# EAGLE design tinyadder_r3 (EAGLE 9.2.2)
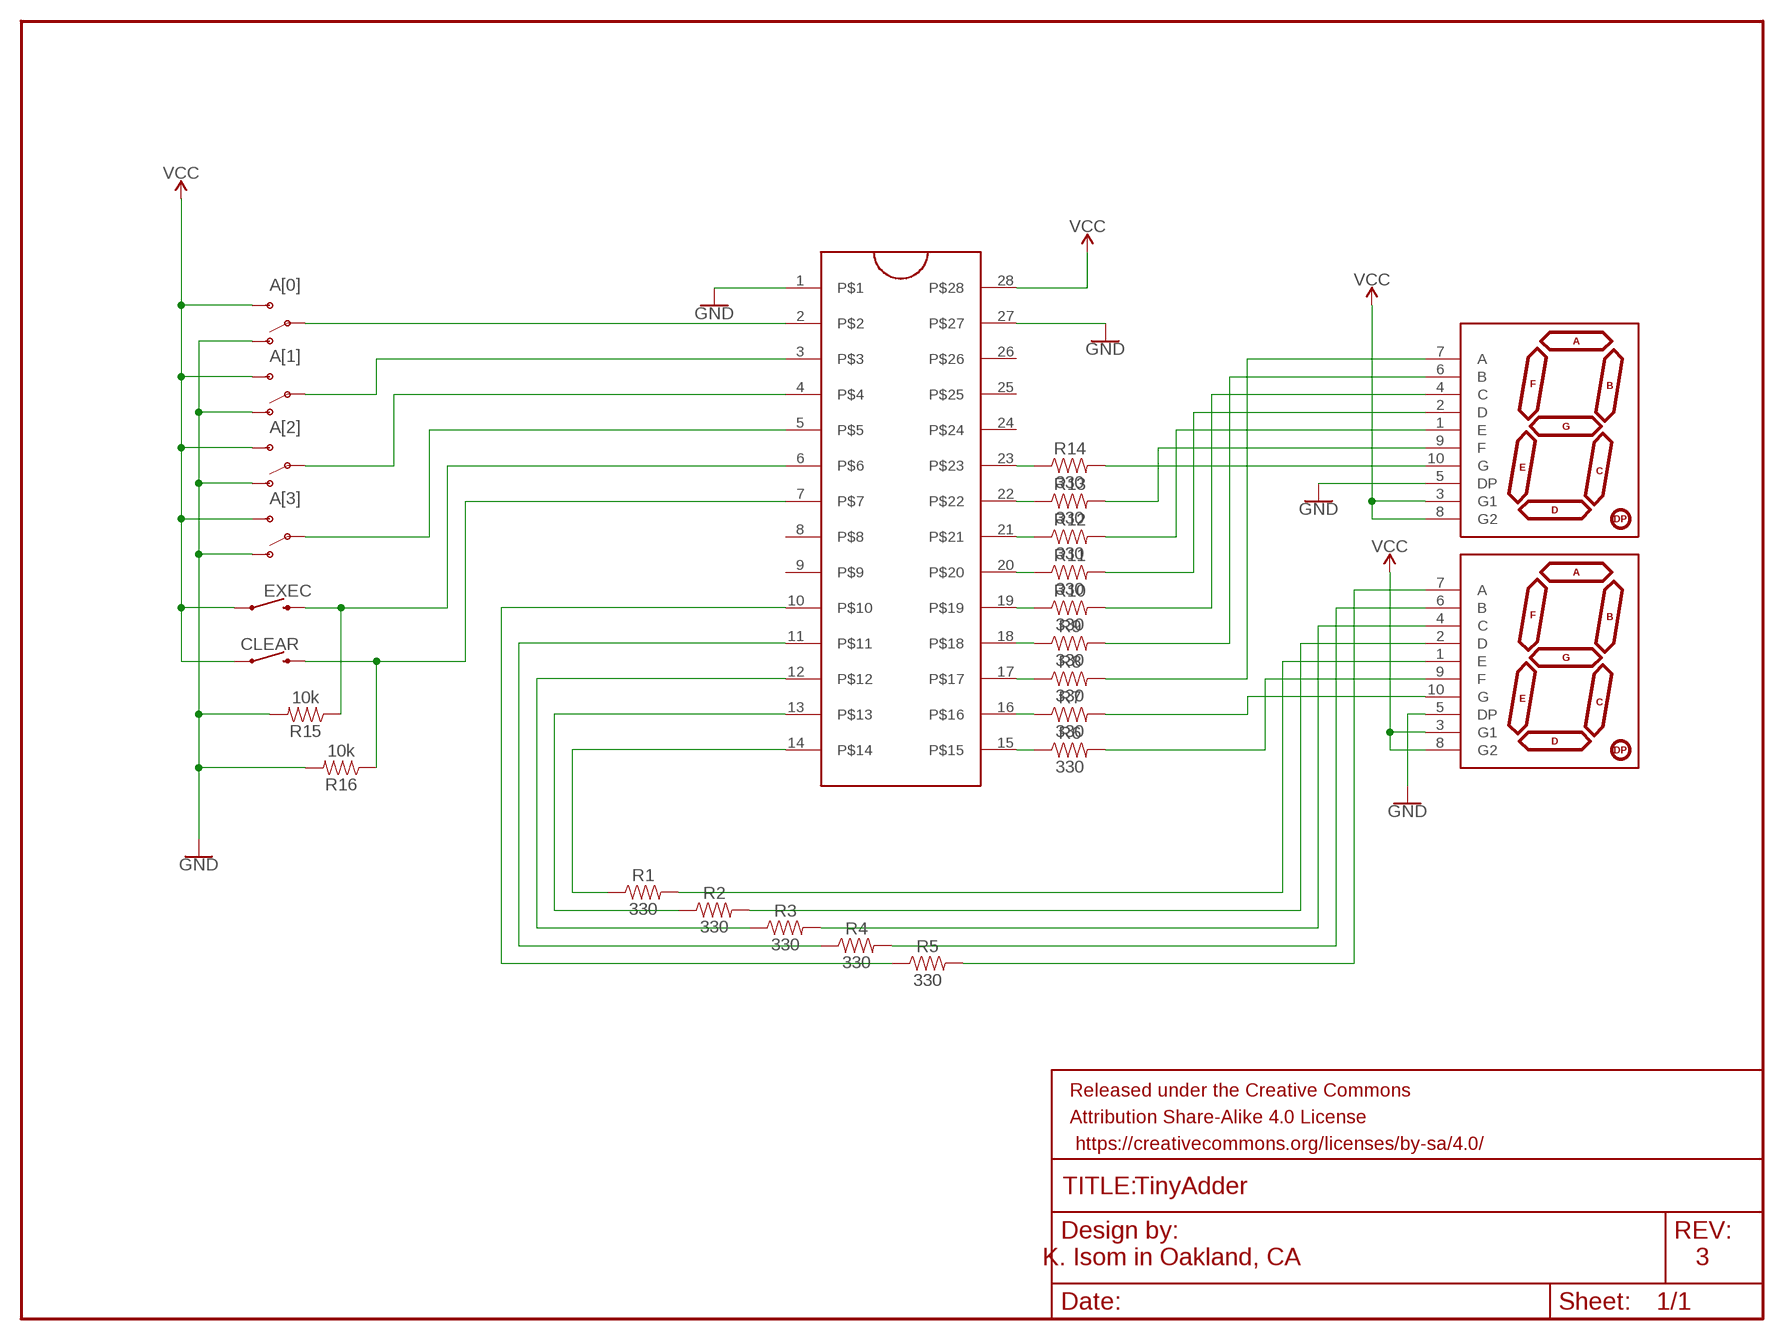
[diagram p0: schematic, sheet 1]

## Parts
A[0]  SWITCH-SPDT-PTH-11.6X4.0MM  [SWITCH_SPDT_PTH_11.6X4.0MM]
A[1]  SWITCH-SPDT-PTH-11.6X4.0MM  [SWITCH_SPDT_PTH_11.6X4.0MM]
A[2]  SWITCH-SPDT-PTH-11.6X4.0MM  [SWITCH_SPDT_PTH_11.6X4.0MM]
A[3]  SWITCH-SPDT-PTH-11.6X4.0MM  [SWITCH_SPDT_PTH_11.6X4.0MM]
CLEAR  MOMENTARY-SWITCH-SPST-PTH-6.0MM  [TACTILE_SWITCH_PTH_6.0MM]
EXEC  MOMENTARY-SWITCH-SPST-PTH-6.0MM  [TACTILE_SWITCH_PTH_6.0MM]
FRAME1  FRAME-LETTER  [CREATIVE_COMMONS]
J1  ZIFSOCKET-28-3"  [DIL28-3-ZIF_SOCKET]
R1  330  330OHM-HORIZ-1/10W-5%  [AXIAL-0.3]
R2  330  330OHM-HORIZ-1/10W-5%  [AXIAL-0.3]
R3  330  330OHM-HORIZ-1/10W-5%  [AXIAL-0.3]
R4  330  330OHM-HORIZ-1/10W-5%  [AXIAL-0.3]
R5  330  330OHM-HORIZ-1/10W-5%  [AXIAL-0.3]
R6  330  330OHM-HORIZ-1/10W-5%  [AXIAL-0.3]
R7  330  330OHM-HORIZ-1/10W-5%  [AXIAL-0.3]
R8  330  330OHM-HORIZ-1/10W-5%  [AXIAL-0.3]
R9  330  330OHM-HORIZ-1/10W-5%  [AXIAL-0.3]
R10  330  330OHM-HORIZ-1/10W-5%  [AXIAL-0.3]
R11  330  330OHM-HORIZ-1/10W-5%  [AXIAL-0.3]
R12  330  330OHM-HORIZ-1/10W-5%  [AXIAL-0.3]
R13  330  330OHM-HORIZ-1/10W-5%  [AXIAL-0.3]
R14  330  330OHM-HORIZ-1/10W-5%  [AXIAL-0.3]
R15  10k  10KOHM-HORIZ-1/4W-1%  [AXIAL-0.3]
R16  10k  10KOHM-HORIZ-1/4W-1%  [AXIAL-0.3]
U$1  YSD-1601AR4B-8  7-SEGMENT-1DIGIT-1INCH-RED  [7-SEGMENT-1"PTH]
U$2  YSD-1601AR4B-8  7-SEGMENT-1DIGIT-1INCH-RED  [7-SEGMENT-1"PTH]

## Nets
GND: A[0].1(O) A[1].1(O) A[2].1(O) A[3].1(O) J1.1 J1.27 R15.P$2 R16.P$2 U$1.5(DP) U$2.5(DP)
N$1: A[0].2(P) J1.2
N$2: A[1].2(P) J1.3
N$3: A[2].2(P) J1.4
N$4: A[3].2(P) J1.5
N$5: EXEC.3 J1.6 R15.P$1
N$6: CLEAR.3 J1.7 R16.P$1
N$7: J1.10 R5.P$1
N$8: J1.11 R4.P$1
N$9: J1.12 R3.P$1
N$10: J1.13 R2.P$1
N$11: R1.P$2 U$2.1(E)
N$12: R6.P$2 U$2.9(F)
N$13: R7.P$2 U$2.10(G)
N$14: R8.P$2 U$1.7(A)
N$15: R9.P$2 U$1.6(B)
N$16: R10.P$2 U$1.4(C)
N$17: R11.P$2 U$1.2(D)
N$18: R12.P$2 U$1.1(E)
N$19: R13.P$2 U$1.9(F)
N$20: J1.15 R6.P$1
N$21: J1.14 R1.P$1
N$22: R2.P$2 U$2.2(D)
N$23: R3.P$2 U$2.4(C)
N$24: R4.P$2 U$2.6(B)
N$25: R5.P$2 U$2.7(A)
N$26: J1.16 R7.P$1
N$27: J1.17 R8.P$1
N$28: J1.18 R9.P$1
N$29: J1.19 R10.P$1
N$30: J1.20 R11.P$1
N$31: J1.21 R12.P$1
N$32: J1.22 R13.P$1
N$33: J1.23 R14.P$1
N$34: R14.P$2 U$1.10(G)
VCC: A[0].3(S) A[1].3(S) A[2].3(S) A[3].3(S) CLEAR.1 EXEC.1 J1.28 U$1.3(G1) U$1.8(G2) U$2.3(G1) U$2.8(G2)
Unconnected: J1.8 J1.9 J1.24 J1.25 J1.26

## Notes on the sheet
- TinyAdder
- K. Isom in Oakland, CA | 3

## Library data of the parts
A[0] A[1] A[2] A[3] = SparkFun-Switches:SWITCH-SPDT: Single Pole, Double Throw (SPDT) Switch Single-pole, double-throw (SPDT) switch. Variant Overview SMD-AYZ0202 Surface Mount DPDT Switch <https://www.sparkfun.com/products/597> (COM-00597) Used on e.g. LilyPad Arduino USB - ATmega32U4 Board <https://www.sparkfun.com/products/12049> PTH-11.6X4.0MM SPDT Mini Power Switch <https://www.sparkfun.com/products/102> (COM-00102) Used on e.g. SparkFun Simon Says - Through-Hole Soldering Kit <https://www.sparkfun.com/products/10547> (KIT-10547) PTH-11.6X4.0MM-KIT KIT version of SPDT Mini Power Switch - Simplifies soldering by removing tStop of switch pins - only one side can be soldered. PTH-11.6X4.0MM-LOCK LOCK version of SPDT Mini Power Switch - Offset pins hold switch in place for easier soldering. SMD-RIGHT-ANGLE Surface Mount Right Angle Switch <https://www.sparkfun.com/products/10860> (COM-10860) Used on e.g. SparkFun ESP8266 Thing <https://www.sparkfun.com/products/13231>; PROD_ID: SWCH-08261; SF_SKU: COM-00102
CLEAR EXEC = SparkFun-Switches:MOMENTARY-SWITCH-SPST: Momentary Switch (Pushbutton) - SPST Normally-open (NO) SPST momentary switches (buttons, pushbuttons). Variants PTH-12MM - 12mm square, through-hole Momentary Pushbutton Switch - 12mm Square <https://www.sparkfun.com/products/9190> (COM-09190) PTH-6.0MM, PTH-6.0MM-KIT - 6.0mm square, through-hole Mini Pushbutton Switch <https://www.sparkfun.com/products/97> (COM-00097) KIT package intended for soldering kit's - only one side of pads' copper is exposed. PTH-RIGHT-ANGLE-KIT - Right-angle, through-hole Right Angle Tactile Button <https://www.sparkfun.com/products/10791> - Used on SparkFun BigTime Watch Kit <https://www.sparkfun.com/products/11734> SMD-12MM - 12mm square, surface-mount Tactile Button - SMD (12mm) <https://www.sparkfun.com/products/12993> (COM-12993) Used on SparkFun PicoBoard <https://www.sparkfun.com/products/11888> SMD-4.5MM - 4.5mm Square Trackball Switch Used on SparkFun Blackberry Trackballer Breakout <https://www.sparkfun.com/products/13169> SMD-4.6MMX2.8MM - 4.60mm x 2.80mm, surface mount Used on SparkFun SAMD21 Mini Breakout <https://www.sparkfun.com/products/13664> SMD-5.2MM, SMD-5.2-REDUNDANT - 5.2mm square, surface-mount Mini Pushbutton Switch - SMD <https://www.sparkfun.com/products/8720> (COM-08720) Used on Arduino Pro Mini <https://www.sparkfun.com/products/11114> REDUNDANT package connects both switch circuits together SMD-6.0X3.5MM - 6.0 x 3.5mm, surface mount Momentary Reset Switch SMD <https://www.sparkfun.com/products/8229> (COM-08229) SMD-6.2MM-TALL - 6.2mm square, surface mount Tactile Button - SMD (6mm) <https://www.sparkfun.com/products/12992> Used on SparkFun Digital Sandbox <https://www.sparkfun.com/products/12651> SMD-RIGHT-ANGLE - Right-angle, surface mount Used on SparkFun Block for Intel® Edison - Arduino <https://www.sparkfun.com/products/13036>; PROD_ID: SWCH-08441; SF_SKU: COM-00097
FRAME1 = SparkFun-Aesthetics:FRAME-LETTER: Schematic Frame - Letter Standard 8.5x11 US Letter frame
J1 = SparkFun-Connectors:ZIFSOCKET-28-3: ZIF Socket 28-Pin 0.3" Lever-action ZIF socket for 28-pin ICs SparkFun Products: ZIF Socket 28-Pin <https://www.sparkfun.com/products/9175>; PROD_ID: CONN-10960; SF_ID: PRT-09175
R1-R14 = SparkFun-Resistors:330OHM: 330Ω resistor A resistor is a passive two-terminal electrical component that implements electrical resistance as a circuit element. Resistors act to reduce current flow, and, at the same time, act to lower voltage levels within circuits. - Wikipedia; PROD_ID: RES-8371
R15 R16 = SparkFun-Resistors:10KOHM: 10kΩ resistor A resistor is a passive two-terminal electrical component that implements electrical resistance as a circuit element. Resistors act to reduce current flow, and, at the same time, act to lower voltage levels within circuits. - Wikipedia; PROD_ID: RES-12183
U$1 U$2 = SparkFun-LED:7-SEGMENT-1DIGIT-1INCH: 7-Segment Display, single digit, 1" EZ is for kits. Pads are only exposed on the bottom side to help prevent soldering in upside down. Datasheet (Red) <https://cdn.sparkfun.com/datasheets/Components/LED/YSD-160AR4B-8.pdf> Datasheet (Blue) <https://cdn.sparkfun.com/datasheets/Components/LED/YSD-160AB3C-8.pdf> SparkFun Products 7-Segment Display - LED (Red) <https://www.sparkfun.com/products/8546> (COM-08546) 7-Segment Display - LED (Blue) <https://www.sparkfun.com/products/9191> (COM-09191); PROD_ID: COMP-08615

## Board
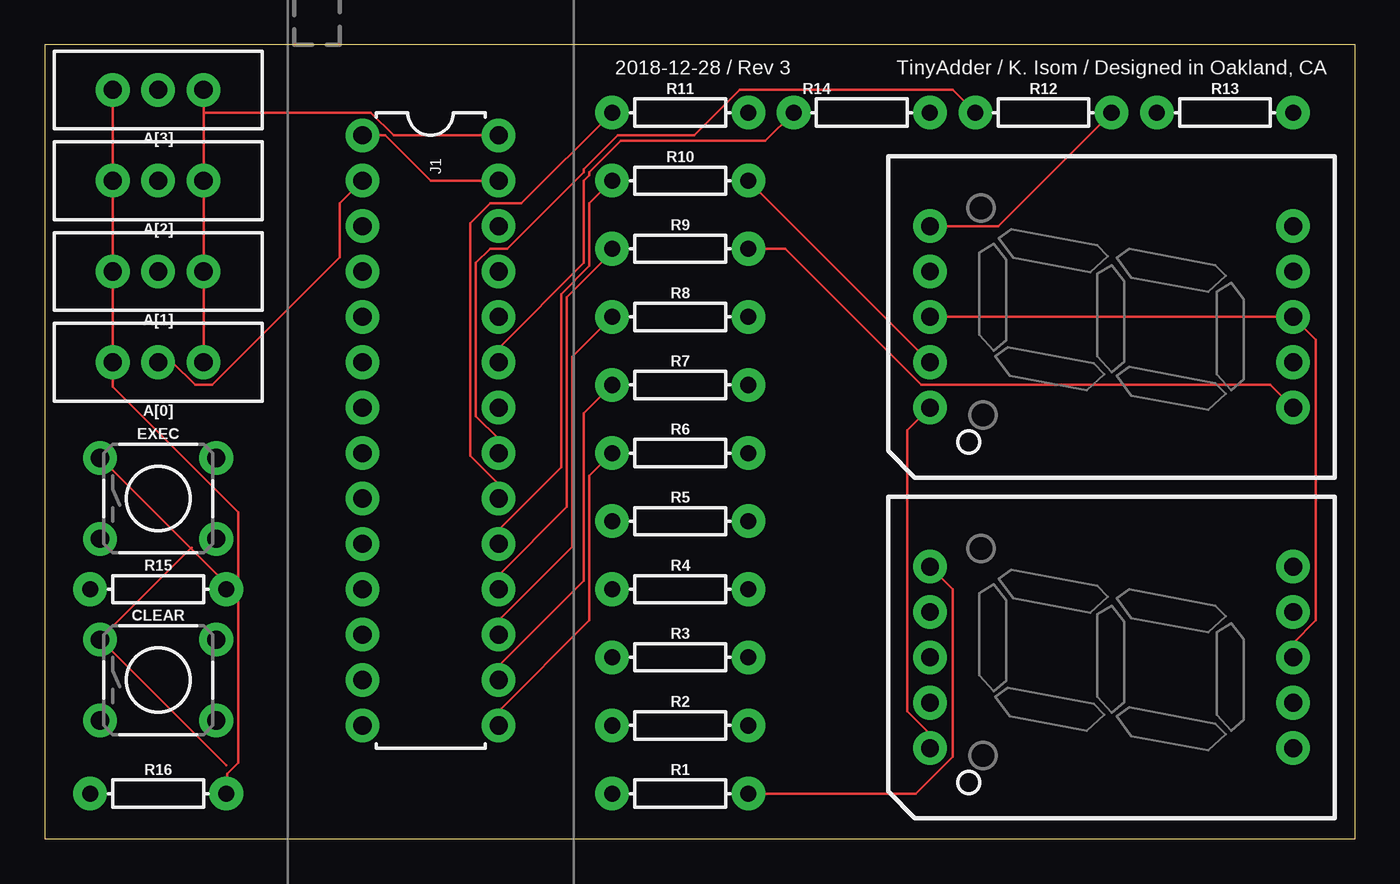
[diagram p1: board, top side]
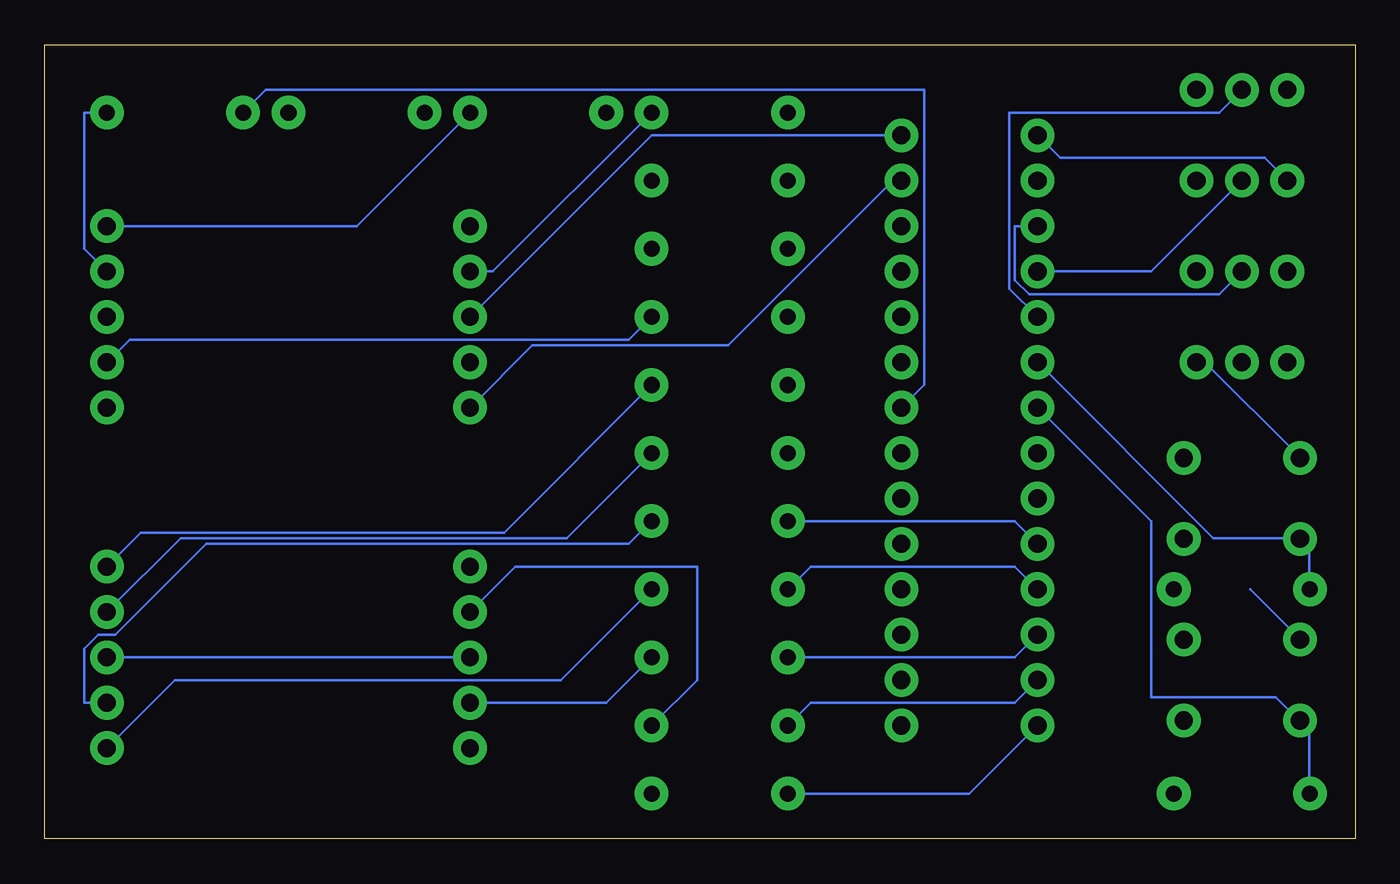
[diagram p2: board, bottom side, seen from below]

Size 73.33 x 44.44 mm. Coordinates in mm from the lower left corner, seen from the top.
Outline: 0,0 73.33,0 73.33,44.44 0,44.44 0,0
Copper layers (1*16): Top 0.035mm / dielectric 1.5mm / Bottom 0.035mm
Design rules "default": minimum track width 6mil, minimum drill 0.35mm, track to track 6mil, track to pad 6mil, pad to pad 6mil, via to via 6mil, smd to smd 6mil, copper to edge 40mil, drill to drill 6mil, minimum pad ring 10mil, minimum via ring 8mil, stop-mask expansion 4mil, vias tented up to drill 0mil, thermal gap 10mil

### Footprints (pad centres in the part's own frame; a part is rotated, then mirrored left to right if it is on the bottom)
SWITCH_SPDT_PTH_11.6X4.0MM = drill 1.016 pad 1.88: 1 0,2.54; 2 0,0; 3 0,-2.54
TACTILE_SWITCH_PTH_6.0MM = drill 1.016 pad 1.88: 1 -3.251,2.261; 2 3.251,2.261; 3 -3.251,-2.261; 4 3.251,-2.261
DIL28-3-ZIF_SOCKET = drill 1.016 pad 1.88: 1 -16.51,-3.81; 2 -13.97,-3.81; 3 -11.43,-3.81; 4 -8.89,-3.81; 5 -6.35,-3.81; 6 -3.81,-3.81; 7 -1.27,-3.81; 8 1.27,-3.81; 9 3.81,-3.81; 10 6.35,-3.81; 11 8.89,-3.81; 12 11.43,-3.81; 13 13.97,-3.81; 14 16.51,-3.81; 15 16.51,3.81; 16 13.97,3.81; 17 11.43,3.81; 18 8.89,3.81; 19 6.35,3.81; 20 3.81,3.81; 21 1.27,3.81; 22 -1.27,3.81; 23 -3.81,3.81; 24 -6.35,3.81; 25 -8.89,3.81; 26 -11.43,3.81; 27 -13.97,3.81; 28 -16.51,3.81
AXIAL-0.3 = drill 0.9 pad 1.88: P$1 -3.81,0; P$2 3.81,0
7-SEGMENT-1"PTH = drill 1 pad 1.88: 1 -5.08,-10.16; 2 -2.54,-10.16; 3 0,-10.16; 4 2.54,-10.16; 5 5.08,-10.16; 6 5.08,10.16; 7 2.54,10.16; 8 0,10.16; 9 -2.54,10.16; 10 -5.08,10.16

### Placement (x,y rotation side)
A[0]  6.35,26.67 90 top
A[1]  6.35,31.75 90 top
A[2]  6.35,36.83 90 top
A[3]  6.35,41.91 90 top
CLEAR  6.35,8.89 0 top
EXEC  6.35,19.05 0 top
FRAME1  21.59,-11.43 0 top  (outside the outline)
J1  21.59,22.86 270 top
R1  35.56,2.54 0 top
R2  35.56,6.35 0 top
R3  35.56,10.16 0 top
R4  35.56,13.97 0 top
R5  35.56,17.78 0 top
R6  35.56,21.59 0 top
R7  35.56,25.4 0 top
R8  35.56,29.21 0 top
R9  35.56,33.02 0 top
R10  35.56,36.83 0 top
R11  35.56,40.64 0 top
R12  55.88,40.64 0 top
R13  66.04,40.64 0 top
R14  45.72,40.64 0 top
R15  6.35,13.97 0 top
R16  6.35,2.54 0 top
U$1  59.69,29.21 270 top
U$2  59.69,10.16 270 top

### Tracks (layer width: path | path; a pad name or v marks a point on that pad's centre or on a via)
GND
  Top 0.152: U$2.5 49.53,5.87 48.26,7.14 48.26,22.86 U$1.5 | J1.1 19.05,39.37 21.59,36.83 J1.27 | A[3].1 A[2].1 A[1].1 A[0].1 3.81,25.3 10.82,18.29 10.82,14.48 10.21,13.87 | 10.21,13.87 10.82,13.26 10.82,4.27 10.21,3.66 10.21,2.59 R16.P$2 | 10.21,13.87 R15.P$2
  Bottom 0.152: J1.1 16.51,38.1 5.08,38.1 A[2].1 | U$1.5 46.04,27.62 35.08,27.62 25.88,36.83 J1.27
N$1
  Top 0.152: A[0].2 7.14,26.67 8.41,25.4 9.37,25.4 16.51,32.54 16.51,35.56 J1.2
N$2
  Bottom 0.152: A[1].2 7.62,30.48 18.26,30.48 19.05,31.27 19.05,34.29 J1.3
N$3
  Bottom 0.152: A[2].2 11.43,31.75 J1.4
N$4
  Bottom 0.152: J1.5 19.37,30.8 19.37,40.64 7.62,40.64 A[3].2
N$5
  Bottom 0.152: 2.54,16.67 3.02,16.67 EXEC.3 | J1.6 7.94,16.83 3.17,16.83 EXEC.3 | R15.P$1 2.59,14.02 2.59,16.61 EXEC.3
N$6
  Bottom 0.152: 2.54,6.51 3.02,6.51 CLEAR.3 | J1.7 11.43,17.78 11.43,7.94 4.45,7.94 3.17,6.67 CLEAR.3 | R16.P$1 2.59,2.59 2.59,6.55 CLEAR.3
N$7
  Bottom 0.152: J1.10 19.05,17.78 R5.P$1
N$8
  Bottom 0.152: J1.11 19.05,15.24 30.48,15.24 R4.P$1
N$9
  Bottom 0.152: J1.12 19.05,10.16 R3.P$1
N$10
  Bottom 0.152: J1.13 19.05,7.62 30.48,7.62 R2.P$1
N$11
  Top 0.152: R1.P$2 48.74,2.54 50.8,4.6 50.8,13.97 U$2.1
N$12
  Bottom 0.152: R6.P$2 44.13,16.83 65.72,16.83 U$2.9
N$13
  Bottom 0.152: R7.P$2 47.62,17.14 67.94,17.14 U$2.10
N$14
  Bottom 0.152: R8.P$2 40.64,27.94 68.58,27.94 U$1.7
N$15
  Top 0.152: R9.P$2 41.43,33.02 49.05,25.4 68.58,25.4 U$1.6
N$16
  Top 0.152: U$1.4 R10.P$2
N$17
  Bottom 0.152: R11.P$2 48.26,31.75 U$1.2
N$18
  Top 0.152: U$1.1 53.34,34.29 R12.P$2
N$19
  Bottom 0.152: U$1.9 71.12,33.02 71.12,40.64 R13.P$2
N$20
  Top 0.152: J1.15 25.4,7.14 30.48,12.22 30.48,20.32 R6.P$1
N$21
  Bottom 0.152: J1.14 21.59,2.54 R1.P$1
N$22
  Bottom 0.152: R2.P$2 36.83,8.89 36.83,15.24 46.99,15.24 U$2.2
N$23
  Bottom 0.152: R3.P$2 41.91,7.62 U$2.4
N$24
  Bottom 0.152: R4.P$2 44.45,8.89 66.04,8.89 U$2.6
N$25
  Bottom 0.152: R5.P$2 40.64,16.51 64.29,16.51 69.37,11.43 70.33,11.43 71.12,10.64 71.12,7.62 U$2.7
N$26
  Top 0.152: J1.16 25.4,9.68 30.16,14.45 30.16,23.81 R7.P$1
N$27
  Top 0.152: J1.17 25.4,12.22 29.53,16.35 29.53,26.99 R8.P$1
N$28
  Top 0.152: J1.18 25.4,14.76 29.21,18.57 29.21,30.32 31.75,32.86 R9.P$1
N$29
  Top 0.152: J1.19 25.4,17.3 28.89,20.8 28.89,30.48 30.48,32.07 30.48,35.56 R10.P$1
N$30
  Top 0.152: J1.20 25.4,19.84 23.81,21.43 23.81,34.45 24.92,35.56 26.67,35.56 R11.P$1
N$31
  Top 0.152: J1.21 25.4,22.38 24.13,23.65 24.13,32.23 24.92,33.02 25.88,33.02 30.16,37.31 30.16,37.47 32.07,39.37 36.35,39.37 38.89,41.91 50.8,41.91 R12.P$1
N$32
  Bottom 0.152: J1.22 24.13,25.4 24.13,41.91 60.96,41.91 R13.P$1
N$33
  Top 0.152: J1.23 25.4,27.46 30.16,32.23 30.16,36.83 30.48,37.15 30.48,37.31 32.23,39.05 40.32,39.05 R14.P$1
N$34
  Bottom 0.152: R14.P$2 55.88,34.29 U$1.10
VCC
  Top 0.152: U$1.3 U$1.8 71.12,27.94 71.12,12.22 69.85,10.95 U$2.8 | 10.16,4.13 3.17,11.11 CLEAR.1 3.2,11.28 8.19,16.26 | 8.89,40.64 A[2].3 A[1].3 A[0].3 | 8.89,40.64 A[3].3 | J1.28 19.53,39.37 18.26,40.64 8.89,40.64 | 8.19,16.26 3.17,21.27 EXEC.1 | 8.19,16.26 10.16,14.29 | 8.23,16.31 8.19,16.26
  Bottom 0.152: U$2.8 U$2.3 | 5.87,13.97 3.17,11.27 CLEAR.1 | A[0].3 8.41,26.67 3.17,21.43 EXEC.1 | U$1.3 39.37,39.37 J1.28

### Text on the board
tPlace: 2018-12-28 / Rev 3 | TinyAdder / K. Isom / Designed in Oakland, CA